# Altium schematic sheet WirelessChargerTx.SchDoc
size A; SheetNumber: 1; SheetTotal: 1; SPICEModelCacheGHGSAJDS: <root> / <DocumentId>GHGSAJDS</DocumentId> / <CacheFrame Number="0"> / <Model Name="1n4148" Kind="MDL"> / <Text>.model 1N4148  D(Is=0.1p Rs=16 CJO=2p Tt=12n Bv=100 Ibv=0.1p)</Text> / </Model> / <Model Name="1n5400" Kind="MDL"> / <Text>*1N5400 MCE / * 50V 3A Si Rectifier pkg:DO-201 1,2 / .MODEL 1N5400 D(IS=2.68E-12 RS=0.00977 N=1.17 TT=1.44E-5 CJO=1.24E-10 / + VJ=0.6 M=0.333 BV=66.6 IBV=1E-5 )</Text> / </Model> / </CacheFrame> / </root>
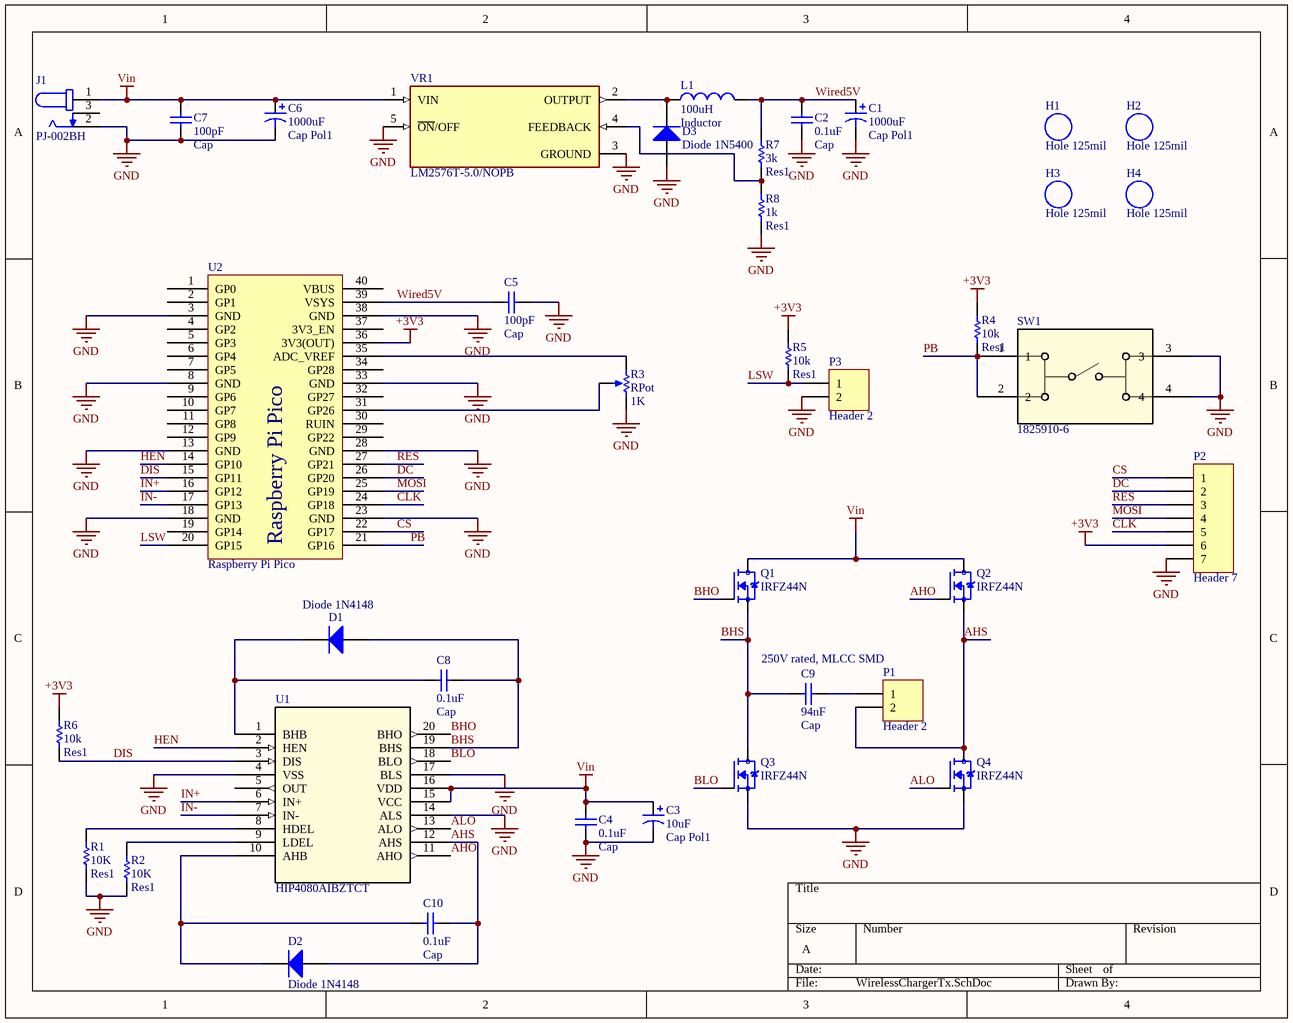
[diagram p0: WirelessChargerTx.SchDoc]

## Parts
C1  Cap Pol1  value 1000uF  [RB7.6-15]
C2  Cap  value 0.1uF  [RAD-0.3]
C3  Cap Pol1  value 10uF  [CAP_10uF]
C4  Cap  value 0.1uF  [c0805]
C5  Cap  value 100pF  [RAD-0.3]
C6  Cap Pol1  value 1000uF  [RB7.6-15]
C7  Cap  value 100pF  [RAD-0.3]
C8  Cap  value 0.1uF  [C0805]
C9  Cap  value 94nF  [C1210]
C10  Cap  value 0.1uF  [C0805]
D1  Diode 1N4148  [DO-35]
D2  Diode 1N4148  [DO-35]
D3  Diode 1N5400  [DO-201AD]
H1  Hole 125mil  [Hole 125mil]
H2  Hole 125mil  [Hole 125mil]
H3  Hole 125mil  [Hole 125mil]
H4  Hole 125mil  [Hole 125mil]
J1  PJ-002BH  [CUI_PJ-002BH]
L1  Inductor  value 100uH  [Inductor100uH]
P1  Header 2  [HDR1X2]
P2  Header 7  [HDR1X7]
P3  Header 2  [HDR1X2]
Q1  IRFZ44N  [TO254P1016X419X2286-3]
Q2  IRFZ44N  [TO254P1016X419X2286-3]
Q3  IRFZ44N  [TO254P1016X419X2286-3]
Q4  IRFZ44N  [TO254P1016X419X2286-3]
R1  Res1  value 10K  [AXIAL-0.3]
R2  Res1  value 10K  [AXIAL-0.3]
R3  RPot  value 1K  [VR5]
R4  Res1  value 10k  [AXIAL-0.3]
R5  Res1  value 10k  [AXIAL-0.3]
R6  Res1  value 10k  [AXIAL-0.3]
R7  Res1  value 3k  [AXIAL-0.3]
R8  Res1  value 1k  [AXIAL-0.3]
SW1  1825910-6  [SW4_1825910-B_TEC]
U1  HIP4080AIBZTCT  [SOIC20_7P60X13_INR]
U2  Raspberry Pi Pico  [Raspberry Pi Pico]
VR1  LM2576T-5.0/NOPB  [T05A_TEX]

## Nets
+3V3: P2.6 R4.2 R5.2 R6.2 U2.36(3V3(OUT))
GND: C1.2 C2.1 C3.2 C4.1 C5.2 C6.2 C7.2 D3.1(A) J1.2 P2.7 P3.2 Q3.3(S) Q4.3(S) R1.1 R2.1 R3.2(BOT) R8.1 SW1.3 SW1.4 U1.4(VSS) U1.14(ALS) U1.17(BLS) U2.3(GND) U2.8(GND) U2.13(GND) U2.18(GND) U2.23(GND) U2.28(GND) U2.33(GND) U2.38(GND) VR1.3(GROUND) VR1.5(~{ON}/OFF)
Vin: C3.1 C4.2 C6.1 C7.1 J1.1 Q1.2(D) Q2.2(D) U1.15(VCC) U1.16(VDD) VR1.1(VIN)
AHO: Q2.1(G) U1.11(AHO)
AHS: C10.2 D2.1(A) P1.2 Q2.3(S) Q4.2(D) U1.12(AHS)
ALO: Q4.1(G) U1.13(ALO)
BHO: Q1.1(G) U1.20(BHO)
BHS: C8.2 C9.1 D1.1(A) Q1.3(S) Q3.2(D) U1.19(BHS)
BLO: Q3.1(G) U1.18(BLO)
CLK: P2.5 U2.24(GP18)
CS: P2.1 U2.22(GP17)
DC: P2.2 U2.26(GP20)
DIS: R6.1 U1.3(DIS) U2.15(GP11)
HEN: U1.2(HEN) U2.14(GP10)
IN+: U1.6(IN+) U2.16(GP12)
IN-: U1.7(IN-) U2.17(GP13)
LSW: P3.1 R5.1 U2.20(GP15)
MOSI: P2.4 U2.25(GP19)
PB: R4.1 SW1.1 SW1.2 U2.21(GP16)
RES: P2.3 U2.27(GP21)
Wired5V: C1.1 C2.2 C5.1 L1.2 R7.2 U2.39(VSYS)
NetC8_1: C8.1 D1.2(K) U1.1(BHB)
NetC9_2: C9.2 P1.1
NetC10_1: C10.1 D2.2(K) U1.10(AHB)
NetD3_2: D3.2(K) L1.1 VR1.2(OUTPUT)
NetR1_2: R1.2 U1.8(HDEL)
NetR2_2: R2.2 U1.9(LDEL)
NetR3_1: R3.1(TOP) U2.35(ADC_VREF)
NetR3_3: R3.3(TAP) U2.31(GP26)
NetR7_1: R7.1 R8.2 VR1.4(FEEDBACK)

Not connected (* = marked no-connect by the designer): J1 3; U1 5(OUT); U2 1(GP0) 2(GP1) 4(GP2) 5(GP3) 6(GP4) 7(GP5) 9(GP6) 10(GP7) 11(GP8) 12(GP9) 19(GP14) 29(GP22) 30(RUIN) 32(GP27) 34(GP28) 37(3V3_EN) 40(VBUS)

## Notes on the sheet
- 250V rated, MLCC SMD

## Library data of the parts
C1 C3 C6 = Cap Pol1: Polarized Capacitor (Radial); Published: 8-Jun-2000; LatestRevisionDate: 17-Jul-2002; LatestRevisionNote: Re-released for DXP Platform.; PackageReference: RB7.6-15; Publisher: Altium Limited; PackageDescription: Polarized Capacitor (Radial); 2 Leads
C2 C4 C5 C7-C10 = Cap: Capacitor; Published: 8-Jun-2000; LatestRevisionDate: 17-Jul-2002; LatestRevisionNote: Re-released for DXP Platform.; PackageReference: RAD-0.3; Publisher: Altium Limited; PackageDescription: Radial Cap, Thru-Hole; 2 Leads; 0.3 in Pin Spacing
D1 D2 = Diode 1N4148: High Conductance Fast Diode; Published: 8-Jun-2000; LatestRevisionDate: 17-Jul-2002; LatestRevisionNote: Re-released for DXP Platform.; DatasheetVersion: 1997; PackageReference: DO-35; Publisher: Altium Limited; PackageDescription: Diode, Axial; Body 3.8 x 1.9 mm (LxDia. max), Lead Dia. 0.53 mm (max); Code_JEDEC: DO-204-AH; ComponentLink1Description: Manufacturer Link; ComponentLink1URL: http://www.fairchildsemi.com/; ComponentLink2Description: Datasheet; ComponentLink2URL: http://www.fairchildsemi.com/ds/1N%2F1N4148.pdf
D3 = Diode 1N5400: 3 Amp General Purpose Rectifier; Published: 8-Jun-2000; LatestRevisionDate: 17-Jul-2002; LatestRevisionNote: Re-released for DXP Platform.; DatasheetVersion: 1998; PackageVersion: Aug-1999; PackageReference: DO-201AD; Publisher: Altium Limited; PackageDescription: Diode, Axial; Body 9.5 x 5.6 mm (LxDia. max), Lead Dia. 1.32 mm (max); ComponentLink1Description: Manufacturer Link; ComponentLink1URL: http://www.fairchildsemi.com/; ComponentLink2Description: Datasheet; ComponentLink2URL: http://www.fairchildsemi.com/ds/1N%2F1N5400.pdf
J1 = PJ-002BH: 2.5 x 6.5 mm, 5.0 A, Horizontal, Through Hole, Dc Power Jack Connector; MF: Same Sky; SnapEDA_Link: https://www.snapeda.com/parts/PJ-002BH/Same+Sky/view-part/?ref=snap; Package: None; Value: *; MP: PJ-002BH; Check_prices: https://www.snapeda.com/parts/PJ-002BH/Same+Sky/view-part/?ref=eda
L1 = Inductor: Code_IEC: 1005; Published: 8-Jun-2000; LatestRevisionDate: 29-May-2009; LatestRevisionNote: IPC-7351 Footprint Added.; PackageReference: 0402-A; Publisher: Altium Limited; PackageDescription: Chip Inductor; Code_JEITA: 0402
P1 P3 = Header 2: Header, 2-Pin; LatestRevisionDate: 17-Jul-2002; LatestRevisionNote: Re-released for DXP Platform.; Publisher: Altium Limited
P2 = Header 7: Header, 7-Pin; LatestRevisionDate: 17-Jul-2002; LatestRevisionNote: Re-released for DXP Platform.; Publisher: Altium Limited
Q1-Q4 = IRFZ44N: N-Channel 55 V 49A (Tc) 94W (Tc) Through Hole TO-220AB; MF: Infineon Technologies; Check_prices: https://www.snapeda.com/parts/IRFZ44N/Infineon+Technologies/view-part/?ref=eda; Package: TO-220-3 Infineon; MP: IRFZ44N; Value: *; Availability: In Stock; Purchase-URL: https://pricing.snapeda.com/search/part/IRFZ44N/?ref=eda; SnapEDA_Link: https://www.snapeda.com/parts/IRFZ44N/Infineon+Technologies/view-part/?ref=snap; Price: None
R1 R2 R4-R8 = Res1: Resistor; Published: 8-Jun-2000; LatestRevisionDate: 17-Jul-2002; LatestRevisionNote: Re-released for DXP Platform.; PackageReference: AXIAL-0.3; Publisher: Altium Limited; PackageDescription: Axial Device, Thru-Hole; 2 Leads; 0.3 in Pin Spacing
R3 = RPot: Potentiometer; Sim Note: Enter the Resistance value and the set point into parameter fields.; Set Position: 0.5; Published: 8-Jun-2000; LatestRevisionDate: 17-Jul-2002; LatestRevisionNote: Re-released for DXP Platform.; PackageReference: VR5; Publisher: Altium Limited; PackageDescription: Variable Resistor, Thru-Hole; 3 Leads
SW1 = 1825910-6: FSM4JH=6MM TACT SWITCH, HIGH TEMP; Manufacturer_Name: TE Connectivity; Copyright: Copyright (C) 2026 Ultra Librarian. All rights reserved.; Manufacturer_Part_Number: 1825910-6; RefDes: RefDes; Type: Type
U1 = HIP4080AIBZTCT: H Bridge Driver; Manufacturer_Name: Renesas / Intersil; Copyright: Copyright (C) 2026 Ultra Librarian. All rights reserved.; Manufacturer_Part_Number: HIP4080AIBZTCT; RefDes: RefDes; Type: Type
VR1 = LM2576T-5.0/NOPB: SIMPLE SWITCHERÂ® 40V, 3A Low Component Count Step-Down Regulator; MF: Texas Instruments; SnapEDA_Link: https://www.snapeda.com/parts/LM2576T-5.0/NOPB/Texas+Instruments/view-part/?ref=snap; Package: TO-220-5 Texas Instruments; Value: *; MP: LM2576T-5.0/NOPB; Check_prices: https://www.snapeda.com/parts/LM2576T-5.0/NOPB/Texas+Instruments/view-part/?ref=eda